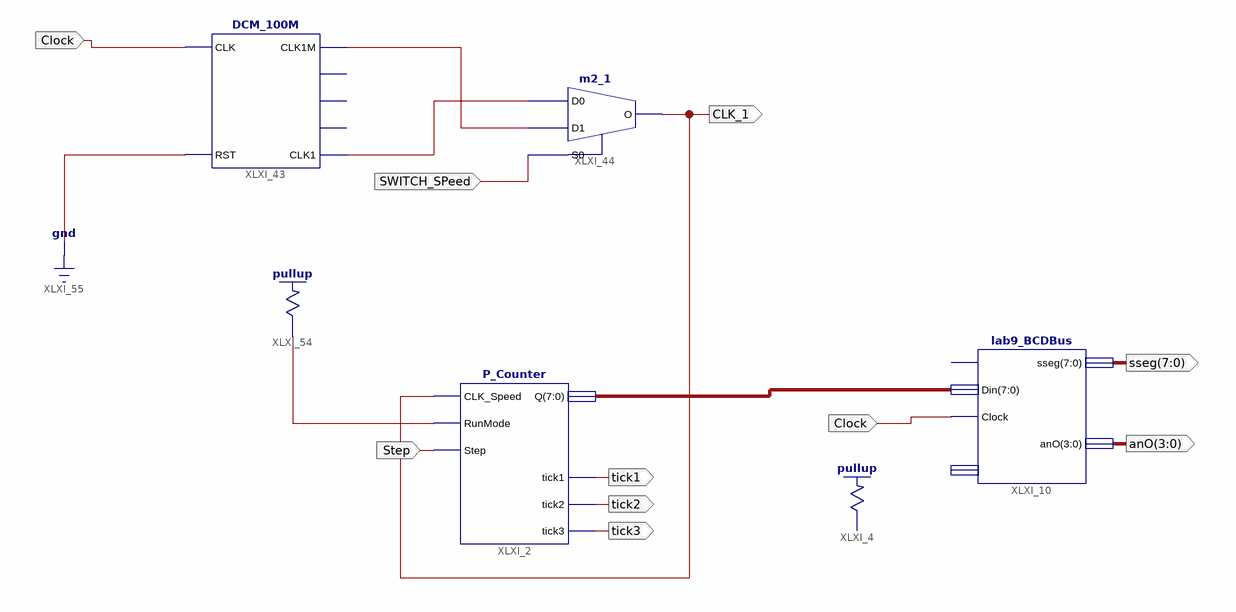
[diagram p0: schematic sheet 1]
// Xilinx ISE schematic test_ProgramCounter.sch (spartan3e) as structural Verilog: 6 symbols, 9 ports
module test_ProgramCounter (
  input  Clock,
  input  SWITCH_SPeed,
  input  Step,
  output tick1,
  output tick2,
  output tick3,
  output [7:0] sseg,
  output [3:0] anO,
  output CLK_1
);

  wire XLXN_34, XLXN_35, XLXN_42;
  wire [7:0] XLXN_52;

  P_Counter XLXI_2 (
    .RunMode(XLXN_42), .CLK_Speed(CLK_1), .Step(Step), .Q(XLXN_52), .tick1(tick1), .tick2(tick2),
    .tick3(tick3));
  DCM_100M XLXI_43 (.CLK(Clock), .RST(1'b0), .CLK1M(XLXN_35), .CLK1(XLXN_34));  // open: CLK10k, CLK1k, CLK100
  m2_1 XLXI_44 (.D0(XLXN_34), .D1(XLXN_35), .S0(SWITCH_SPeed), .O(CLK_1));
  \pullup  XLXI_54 (.O(XLXN_42));
  lab9_BCDBus XLXI_10 (.Din(XLXN_52), .Clock(Clock), .sseg(sseg), .anO(anO));  // open: En, A
  \pullup  XLXI_4 ();  // open: O
endmodule
